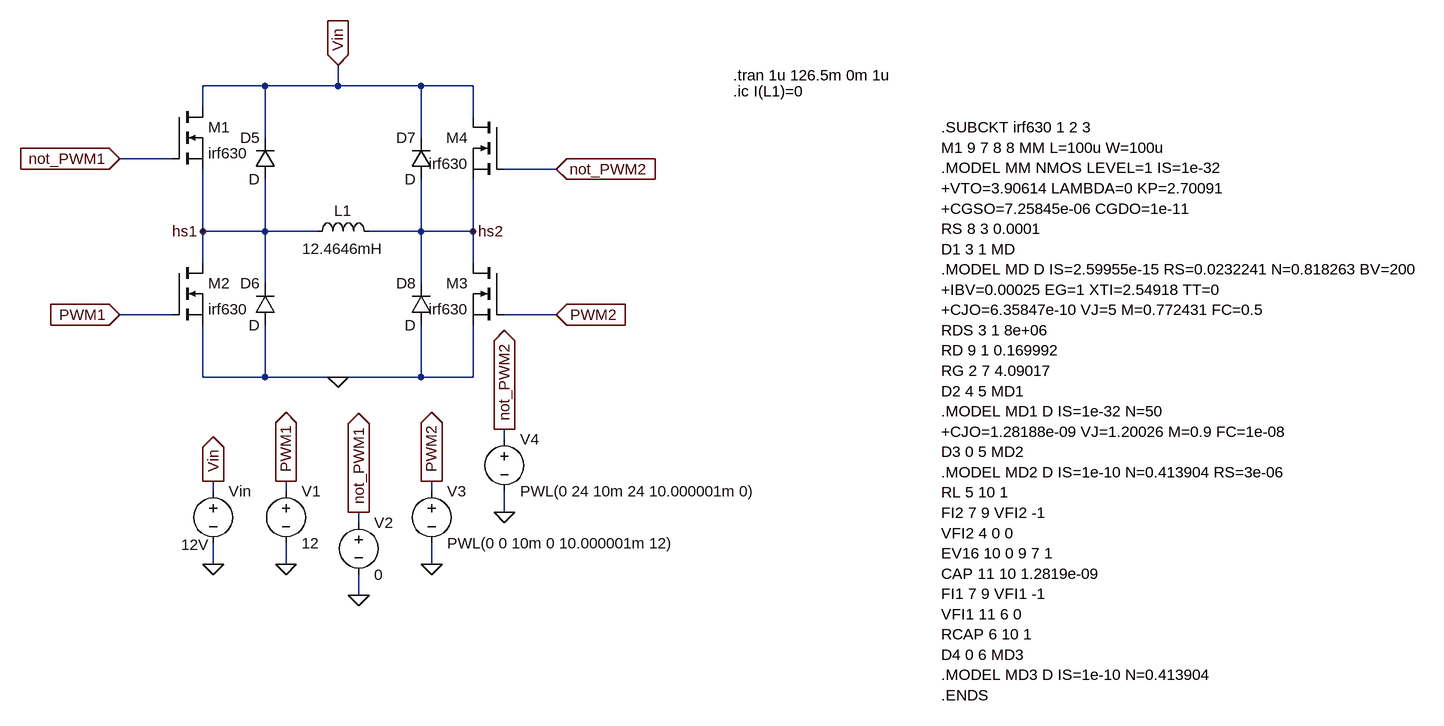
[diagram p0: schematic Desmag3.asc]
Desmag3.asc, the LTspice schematic file:
Version 4
SHEET 1 2804 680
WIRE -64 -208 -160 -208
WIRE 48 -208 48 -240
WIRE 48 -208 -64 -208
WIRE 176 -208 48 -208
WIRE 256 -208 176 -208
WIRE -160 -176 -160 -208
WIRE 256 -160 256 -208
WIRE -64 -128 -64 -208
WIRE 176 -128 176 -208
WIRE -208 -96 -288 -96
WIRE 384 -80 304 -80
WIRE -160 16 -160 -80
WIRE -64 16 -64 -64
WIRE -64 16 -160 16
WIRE 16 16 -64 16
WIRE 176 16 176 -64
WIRE 176 16 96 16
WIRE 256 16 256 -64
WIRE 256 16 176 16
WIRE -160 64 -160 16
WIRE 256 64 256 16
WIRE -64 96 -64 16
WIRE 176 96 176 16
WIRE -208 144 -288 144
WIRE 384 144 304 144
WIRE -160 240 -160 160
WIRE -64 240 -64 160
WIRE -64 240 -160 240
WIRE 48 240 -64 240
WIRE 176 240 176 160
WIRE 176 240 48 240
WIRE 256 240 256 160
WIRE 256 240 176 240
WIRE 304 336 304 320
WIRE -144 416 -144 400
WIRE -32 416 -32 400
WIRE 192 416 192 400
WIRE 304 448 304 416
WIRE 80 464 80 448
WIRE -144 528 -144 496
WIRE -32 528 -32 496
WIRE 192 528 192 496
WIRE 80 576 80 544
FLAG -144 528 0
FLAG -144 400 Vin
IOPIN -144 400 Out
FLAG 48 -240 Vin
IOPIN 48 -240 In
FLAG -160 16 hs1
FLAG 256 16 hs2
FLAG 48 240 0
FLAG -32 528 0
FLAG -32 400 PWM1
IOPIN -32 400 Out
FLAG 80 576 0
FLAG 80 448 not_PWM1
IOPIN 80 448 Out
FLAG 192 528 0
FLAG 192 400 PWM2
IOPIN 192 400 Out
FLAG 304 448 0
FLAG 304 320 not_PWM2
IOPIN 304 320 Out
FLAG -288 144 PWM1
IOPIN -288 144 In
FLAG -288 -96 not_PWM1
IOPIN -288 -96 In
FLAG 384 144 PWM2
IOPIN 384 144 In
FLAG 384 -80 not_PWM2
IOPIN 384 -80 In
SYMBOL voltage -144 400 R0
WINDOW 3 -49 98 Left 2
WINDOW 123 0 0 Left 0
WINDOW 39 0 0 Left 0
SYMATTR Value 12V
SYMATTR InstName Vin
SYMBOL ind 0 32 R270
WINDOW 0 32 56 VTop 2
WINDOW 3 5 56 VBottom 2
SYMATTR InstName L1
SYMATTR Value 12.4646mH
SYMATTR SpiceLine Rser=1.58
SYMBOL diode -48 -64 R180
WINDOW 0 24 64 Left 2
WINDOW 3 24 0 Left 2
SYMATTR InstName D5
SYMBOL diode -48 160 R180
WINDOW 0 24 64 Left 2
WINDOW 3 24 0 Left 2
SYMATTR InstName D6
SYMBOL diode 192 -64 R180
WINDOW 0 24 64 Left 2
WINDOW 3 24 0 Left 2
SYMATTR InstName D7
SYMBOL diode 192 160 R180
WINDOW 0 24 64 Left 2
WINDOW 3 24 0 Left 2
SYMATTR InstName D8
SYMBOL voltage -32 400 R0
WINDOW 123 0 0 Left 0
WINDOW 39 0 0 Left 0
SYMATTR InstName V1
SYMATTR Value 12
SYMBOL nmos -208 -176 R0
SYMATTR InstName M1
SYMATTR Value irf630
SYMATTR Prefix X
SYMBOL nmos -208 64 R0
SYMATTR InstName M2
SYMATTR Value irf630
SYMATTR Prefix X
SYMBOL nmos 304 64 M0
SYMATTR InstName M3
SYMATTR Value irf630
SYMATTR Prefix X
SYMBOL nmos 304 -160 M0
SYMATTR InstName M4
SYMATTR Value irf630
SYMATTR Prefix X
SYMBOL voltage 80 448 R0
WINDOW 123 0 0 Left 0
WINDOW 39 0 0 Left 0
SYMATTR InstName V2
SYMATTR Value 0
SYMBOL voltage 192 400 R0
WINDOW 123 0 0 Left 0
WINDOW 39 0 0 Left 0
SYMATTR InstName V3
SYMATTR Value PWL(0 0 10m 0 10.000001m 12)
SYMBOL voltage 304 320 R0
WINDOW 123 0 0 Left 0
WINDOW 39 0 0 Left 0
SYMATTR InstName V4
SYMATTR Value PWL(0 24 10m 24 10.000001m 0)
TEXT 656 -224 Left 2 !.tran 1u 126.5m 0m 1u
TEXT 976 -144 Left 2 !.SUBCKT irf630 1 2 3\nM1 9 7 8 8 MM L=100u W=100u\n.MODEL MM NMOS LEVEL=1 IS=1e-32\n+VTO=3.90614 LAMBDA=0 KP=2.70091\n+CGSO=7.25845e-06 CGDO=1e-11\nRS 8 3 0.0001\nD1 3 1 MD\n.MODEL MD D IS=2.59955e-15 RS=0.0232241 N=0.818263 BV=200\n+IBV=0.00025 EG=1 XTI=2.54918 TT=0\n+CJO=6.35847e-10 VJ=5 M=0.772431 FC=0.5\nRDS 3 1 8e+06\nRD 9 1 0.169992\nRG 2 7 4.09017\nD2 4 5 MD1\n.MODEL MD1 D IS=1e-32 N=50\n+CJO=1.28188e-09 VJ=1.20026 M=0.9 FC=1e-08\nD3 0 5 MD2\n.MODEL MD2 D IS=1e-10 N=0.413904 RS=3e-06\nRL 5 10 1\nFI2 7 9 VFI2 -1\nVFI2 4 0 0\nEV16 10 0 9 7 1\nCAP 11 10 1.2819e-09\nFI1 7 9 VFI1 -1\nVFI1 11 6 0\nRCAP 6 10 1\nD4 0 6 MD3\n.MODEL MD3 D IS=1e-10 N=0.413904\n.ENDS
TEXT 656 -200 Left 2 !.ic I(L1)=0

The netlist it stands for:
* Desmag3.asc
Vin Vin 0 12V
L1 hs1 hs2 12.4646mH Rser=1.58
D5 hs1 Vin D
D6 0 hs1 D
D7 hs2 Vin D
D8 0 hs2 D
V1 PWM1 0 12
XM1 Vin not_PWM1 hs1 irf630  ; pins D G S
XM2 hs1 PWM1 0 irf630  ; pins D G S
XM3 hs2 PWM2 0 irf630  ; pins D G S
XM4 Vin not_PWM2 hs2 irf630  ; pins D G S
V2 not_PWM1 0 0
V3 PWM2 0 PWL(0 0 10m 0 10.000001m 12)
V4 not_PWM2 0 PWL(0 24 10m 24 10.000001m 0)
.model D D
.lib standard.dio
.tran 1u 126.5m 0m 1u
.SUBCKT irf630 1 2 3
M1 9 7 8 8 MM L=100u W=100u
.MODEL MM NMOS LEVEL=1 IS=1e-32
+VTO=3.90614 LAMBDA=0 KP=2.70091
+CGSO=7.25845e-06 CGDO=1e-11
RS 8 3 0.0001
D1 3 1 MD
.MODEL MD D IS=2.59955e-15 RS=0.0232241 N=0.818263 BV=200
+IBV=0.00025 EG=1 XTI=2.54918 TT=0
+CJO=6.35847e-10 VJ=5 M=0.772431 FC=0.5
RDS 3 1 8e+06
RD 9 1 0.169992
RG 2 7 4.09017
D2 4 5 MD1
.MODEL MD1 D IS=1e-32 N=50
+CJO=1.28188e-09 VJ=1.20026 M=0.9 FC=1e-08
D3 0 5 MD2
.MODEL MD2 D IS=1e-10 N=0.413904 RS=3e-06
RL 5 10 1
FI2 7 9 VFI2 -1
VFI2 4 0 0
EV16 10 0 9 7 1
CAP 11 10 1.2819e-09
FI1 7 9 VFI1 -1
VFI1 11 6 0
RCAP 6 10 1
D4 0 6 MD3
.MODEL MD3 D IS=1e-10 N=0.413904
.ENDS
.ic I(L1)=0
.backanno
.end

* Results of the author's LTspice run, read from the files saved beside the schematic
* Operating Point, zero values left out:
*   V(vin) = 12 V
*   V(hs1) = 324 nV
*   V(hs2) = 12 V
*   V(pwm1) = 12 V
*   V(not_pwm2) = 24 V
*   I(D8) = -12.01 pA
*   I(D5) = -12.01 pA
*   I(L1) = -962.7 pA
*   I(V3) = 12 pA
*   I(V2) = 12 pA
*   I(Vin) = -3.001 µA
*   Ix(m1:1) = 1.5 µA
*   Ix(m1:2) = -12 pA
*   Ix(m1:3) = -1.5 µA
*   Ix(m2:1) = 1.501 µA
*   Ix(m2:3) = -1.501 µA
*   Ix(m3:1) = 1.5 µA
*   Ix(m3:2) = -12 pA
*   Ix(m3:3) = -1.5 µA
*   Ix(m4:1) = 1.501 µA
*   Ix(m4:3) = -1.501 µA
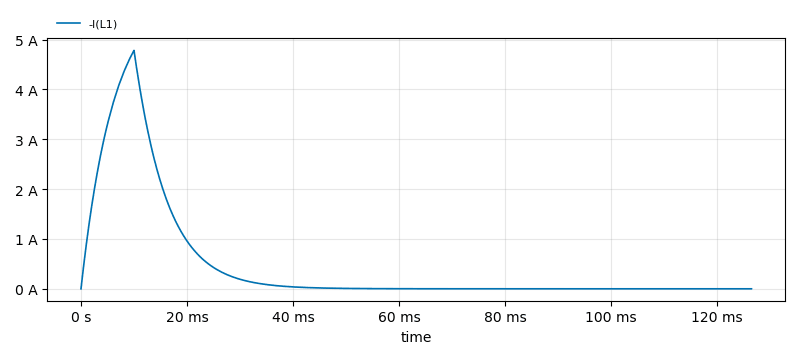
[diagram p1: Transient Analysis of Desmag3.asc, plotted from the saved traces]
* Transient Analysis, 1 run:
*   -I(L1): min 0 A, max 4.782 A, average 473.1 mA, rms 1.194 A, last 0 A